# EAGLE design HelloLED (EAGLE 7.5.0)
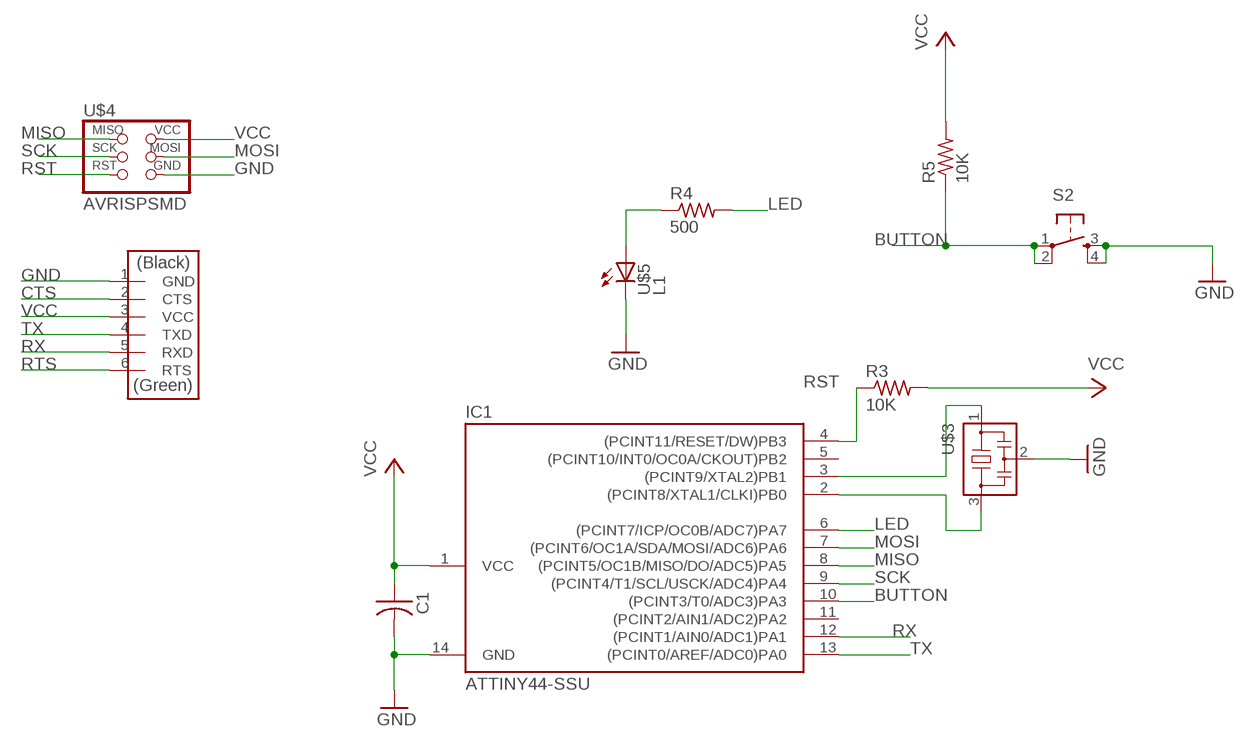
[diagram p0: schematic, sheet 1]

## Parts
C1  CAP-US1206FAB  [C1206FAB]
IC1  ATTINY44-SSU  [SOIC14]
R3  10K  RES-US1206FAB  [R1206FAB]
R4  500  RES-US1206FAB  [R1206FAB]
R5  10K  RES-US1206FAB  [R1206FAB]
S2  6MM_SWITCH6MM_SWITCH  [6MM_SWITCH]
U$1  FTDI-SMD-HEADER  [1X06SMD]
U$3  RESONATOR  [EFOBM]
U$4  AVRISPSMD  [2X03SMD]
U$5  L1  LEDFAB1206  [LED1206FAB]

## Nets
BUTTON: IC1.10((PCINT3/T0/ADC3)PA3) R5.1 S2.1(P) S2.2(P1)
CTS: U$1.2(CTS)
GND: C1.2 IC1.14(GND) S2.3(S) S2.4(S1) U$1.1(GND) U$3.2 U$4.6(GND) U$5.2(C)
LED: IC1.6((PCINT7/ICP/OC0B/ADC7)PA7) R4.2
MISO: IC1.8((PCINT5/OC1B/MISO/DO/ADC5)PA5) U$4.1(MISO)
MOSI: IC1.7((PCINT6/OC1A/SDA/MOSI/ADC6)PA6) U$4.4(MOSI)
N$2: IC1.2((PCINT8/XTAL1/CLKI)PB0) U$3.3
N$3: IC1.3((PCINT9/XTAL2)PB1) U$3.1
N$10: R4.1 U$5.1(A)
RST: IC1.4((PCINT11/RESET/DW)PB3) R3.1 U$4.5(RST)
RTS: U$1.6(RTS)
RX: IC1.12((PCINT1/AIN0/ADC1)PA1) U$1.5(RXD)
SCK: IC1.9((PCINT4/T1/SCL/USCK/ADC4)PA4) U$4.3(SCK)
TX: IC1.13((PCINT0/AREF/ADC0)PA0) U$1.4(TXD)
VCC: C1.1 IC1.1(VCC) R3.2 R5.2 U$1.3(VCC) U$4.2(VCC)
Unconnected: IC1.5((PCINT10/INT0/OC0A/CKOUT)PB2) IC1.11((PCINT2/AIN1/ADC2)PA2)

## Library data of the parts
C1 = fab:CAP-US; OC_NEWARK: unknown
IC1 = fab:ATTINY44; OC_NEWARK: unknown
R3 R5 = fab:RES-US: Resistor (US Symbol) Variants with postfix FAB are widened to allow the routing of internal traces; MF: AVX CORPORATION; MPN: 12106D226KAT2A; OC_NEWARK: 25H7690
R4 = fab:RES-US: Resistor (US Symbol) Variants with postfix FAB are widened to allow the routing of internal traces; OC_NEWARK: unknown
S2 = fab:6MM_SWITCH: OMRON SWITCH; OC_NEWARK: unknown
U$1 = fab:FTDI-SMD-HEADER; OC_NEWARK: unknown
U$3 = fab:RESONATOR; OC_NEWARK: unknown
U$4 = fab:AVRISP; OC_NEWARK: unknown
U$5 = fab:LED: LED; OC_NEWARK: unknown

## Board
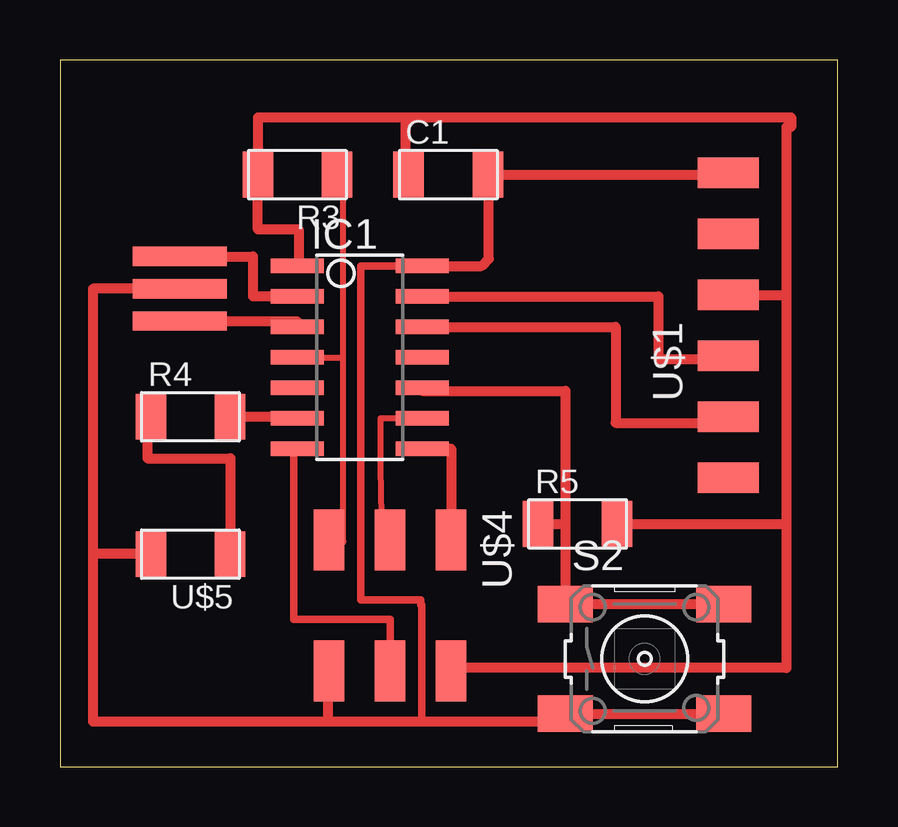
[diagram p1: board, top side]

Size 32.41 x 29.47 mm. Coordinates in mm from the lower left corner, seen from the top.
Outline: 0,0 32.41,0 32.41,29.47 0,29.47 0,0
Copper layers (1*16): Top 0.035mm / dielectric 1.5mm / Bottom 0.035mm
Design rules "default *": minimum track width 16mil, minimum drill 24mil, track to track 16mil, track to pad 16mil, pad to pad 16mil, via to via 16mil, smd to smd 16mil, copper to edge 40mil, drill to drill 8mil, minimum pad ring 10mil, minimum via ring 8mil, stop-mask expansion 4mil, vias tented up to drill 0mil, thermal gap 10mil

### Footprints (pad centres in the part's own frame; a part is rotated, then mirrored left to right if it is on the bottom)
C1206FAB = smd 1.27 x 1.905: 1 -1.651,0; 2 1.651,0
SOIC14 = smd 0.61 x 2.21: 1 -3.81,-2.603; 2 -2.54,-2.603; 3 -1.27,-2.603; 4 0,-2.603; 5 1.27,-2.603; 6 2.54,-2.603; 7 3.81,-2.603; 8 3.81,2.603; 9 2.54,2.603; 10 1.27,2.603; 11 0,2.603; 12 -1.27,2.603; 13 -2.54,2.603; 14 -3.81,2.603
R1206FAB = smd 1.27 x 1.905: 1 -1.651,0; 2 1.651,0
6MM_SWITCH = smd 2.286 x 1.524: 1 -3.302,2.286; 2 3.302,2.286; 3 -3.302,-2.286; 4 3.302,-2.286
1X06SMD = smd 2.54 x 1.27: 1 0,6.35; 2 0,3.81; 3 0,1.27; 4 0,-1.27; 5 0,-3.81; 6 0,-6.35
EFOBM = smd 0.8 x 3.9: 1 -1.35,0; 2 0,0; 3 1.35,0
2X03SMD = smd 2.54 x 1.27: 1 -2.54,2.54; 2 2.92,2.54; 3 -2.54,0; 4 2.92,0; 5 -2.54,-2.54; 6 2.92,-2.54
LED1206FAB = smd 1.27 x 1.905: 1 -1.651,0; 2 1.651,0

### Placement (x,y rotation side)
C1  16.18,24.69 0 top
IC1  12.48,17.07 270 top
R3  9.89,24.69 180 top
R4  5.44,14.59 0 top
R5  21.56,10.12 0 top
S2  24.36,4.5 0 top
U$1  27.85,18.4 0 top
U$3  4.99,19.93 90 top
U$4  13.75,6.91 270 top
U$5  5.44,8.86 180 top

### Tracks (layer width: path | path; a pad name or v marks a point on that pad's centre or on a via)
BUTTON
  Top 0.406: IC1.10 15.09,15.67 21.06,15.67 21.06,10.12 | 20.49,6.78 S2.1 | S2.1 S2.2 | 21.06,10.12 S2.1 | R5.1 21.06,10.12
GND
  Top 0.305: IC1.14 12.54,20.88 12.54,6.96 15.02,6.96 15.02,6.76 15.08,6.76 15.08,1.89
  Top 0.406: 26.71,24.69 26.71,24.56 27.6,24.56 27.6,24.75 U$1.1 27.85,24.69 C1.2 17.87,24.65 17.87,21.18 17.56,20.88 IC1.14 | S2.4 S2.3 21.06,1.89 15.08,1.89 11.15,1.89 | U$3.2 1.37,19.93 1.37,8.86 | 1.37,8.86 1.37,1.89 11.15,1.89 | U$4.6 11.15,3.99 11.15,1.89 | U$5.2 1.37,8.86
LED
  Top 0.406: R4.2 9.88,14.59 IC1.6
MISO
  Top 0.406: IC1.8 16.29,13.26 U$4.1
MOSI
  Top 0.305: IC1.7 9.74,13.26 9.74,6.15 13.75,6.15 U$4.4
N$2
  Top 0.406: U$3.3 8.04,21.28 8.04,19.61 IC1.2
N$3
  Top 0.406: U$3.1 9.88,18.58 IC1.3
N$10
  Top 0.406: R4.1 3.65,14.59 3.65,12.85 7.09,12.85 | 7.1,12.85 7.09,12.85 | 7.09,12.85 U$5.1
RST
  Top 0.254: R3.1 11.77,24.69 11.77,17.07 | 11.77,17.07 11.77,9.4 | IC1.4 11.77,17.07
  Top 0.305: 11.77,9.4 11.21,9.4 U$4.5
RX
  Top 0.406: IC1.12 23.15,18.34 23.15,14.34 27.85,14.34 U$1.5
SCK
  Top 0.254: IC1.9 13.35,14.53 13.4,14.48 13.35,14.48 13.35,12.45 13.4,9.45 U$4.3
TX
  Top 0.406: IC1.13 24.93,19.61 24.93,17.01 27.85,17.01 U$1.4
VCC
  Top 0.406: IC1.1 9.94,20.88 9.94,22.4 8.24,22.4 R3.2 8.24,27.08 14.41,27.08 | 14.41,27.08 30.47,27.08 30.47,26.67 30.26,26.67 30.26,19.67 | 30.26,19.67 30.26,10.12 | 30.26,10.12 30.26,4.11 16.29,4.11 U$4.2 | C1.1 14.41,24.69 14.41,27.08 | U$1.3 30.26,19.67 | R5.2 30.26,10.12